# Altium project mcu_board.PrjPCB
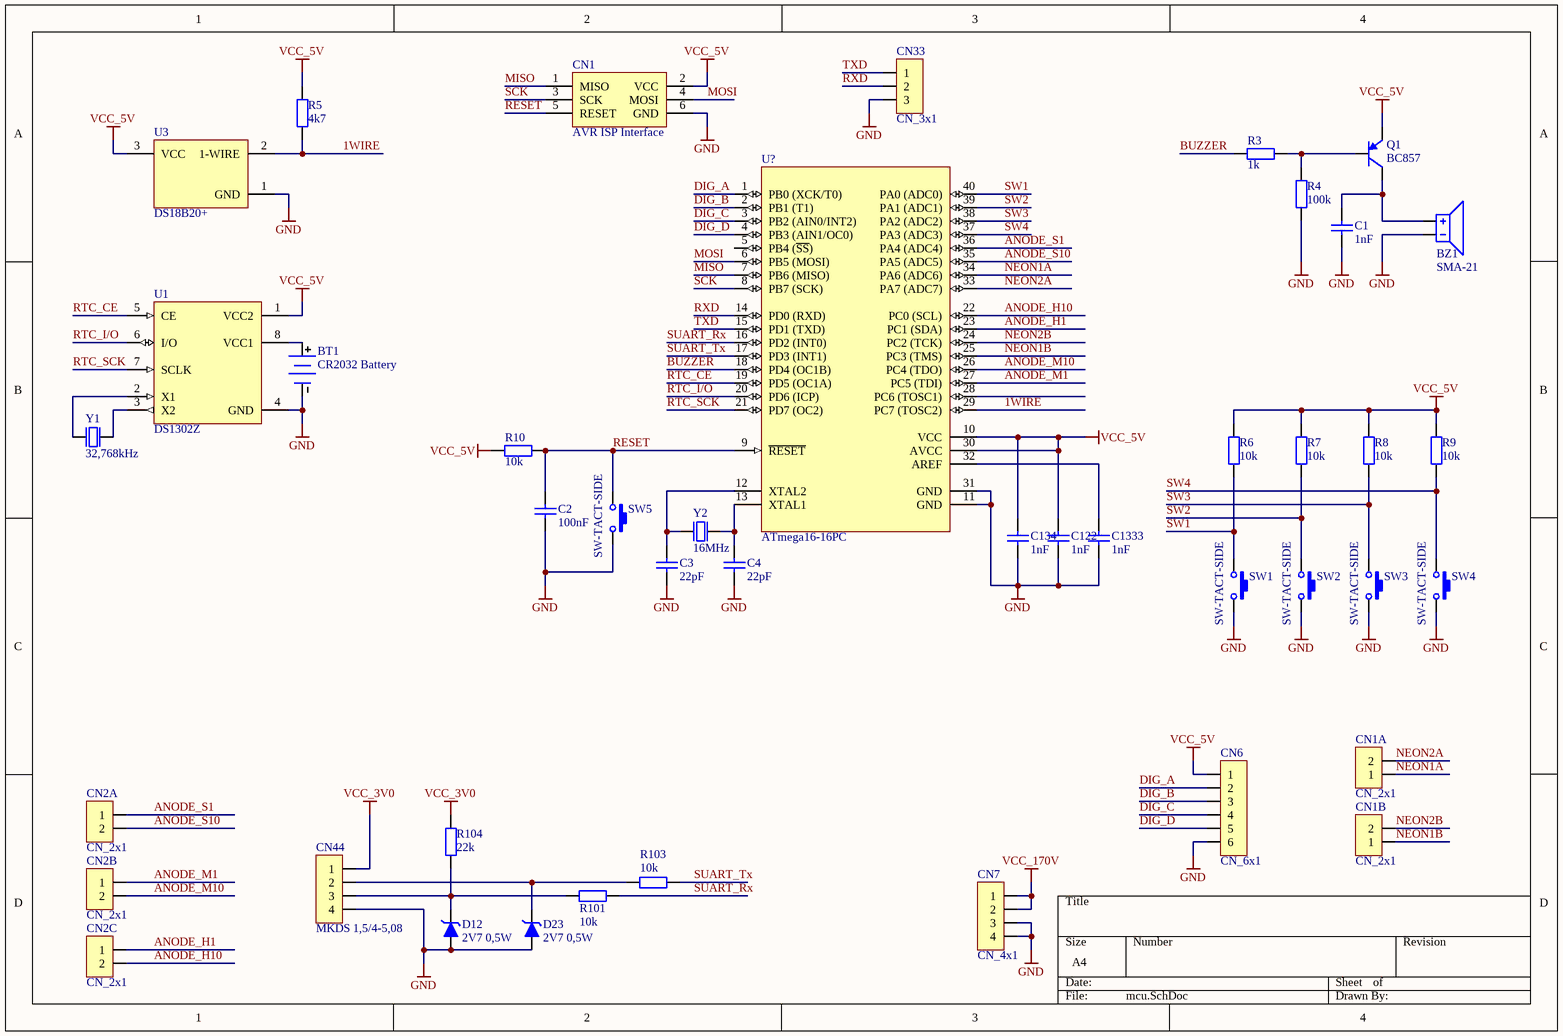
[diagram p0: mcu.SchDoc]
2 sheets, 74 parts. Net scope: global (net labels, ports and power ports of the same name join across sheets).
Board file: mcu_board.PcbDoc
Sheets:
  mcu.SchDoc
  power.SchDoc

## Sheet mcu.SchDoc
size A4

### Parts
BT1  CR2032 Battery  [SN2032]
BZ1  SMA-21  [SMA-21 P10]
C1  1nF  [C0805]
C2  100nF  [C0805]
C3  22pF  [C0805]
C4  22pF  [C0805]
C122  1nF  [C0805]
C134  1nF  [C0805]
C1333  1nF  [C0805]
CN1  AVR ISP Interface  [IDC6_RA]
CN1A  CN_2x1  [GP_2x1]
CN1B  CN_2x1  [GP_2x1]
CN2A  CN_2x1  [GP_2x1]
CN2B  CN_2x1  [GP_2x1]
CN2C  CN_2x1  [GP_2x1]
CN6  CN_6x1  [GP_6x1]
CN7  CN_4x1  [GP_4x1]
CN33  CN_3x1  [GP_3x1H]
CN44  MKDS 1,5/4-5,08  [MKDS 1,5/4-5,08]
D12  2V7 0,5W  [MiniMELF]
D23  2V7 0,5W  [MiniMELF]
Q1  BC857  [SOT-23]
R3  1k  [R0805]
R4  100k  [R0805]
R5  4k7  [R0805]
R6  10k  [R0805]
R7  10k  [R0805]
R8  10k  [R0805]
R9  10k  [R0805]
R10  10k  [R0805]
R101  10k  [R0805]
R103  10k  [R0805]
R104  22k  [R0805]
SW1  SW-TACT-SIDE  [TACT_SO_THT]
SW2  SW-TACT-SIDE  [TACT_SO_THT]
SW3  SW-TACT-SIDE  [TACT_SO_THT]
SW4  SW-TACT-SIDE  [TACT_SO_THT]
SW5  SW-TACT-SIDE  [TACT_SO_THT]
U1  DS1302Z  [SO8]
U3  DS18B20+  [TO-92D]
U?  ATmega16-16PC  [DIP40]
Y1  32,768kHz  [85SMX]
Y2  16MHz  [HC49-S]

### Nets
GND: BT1.2(-) BZ1.2 C1.1 C2.1 C3.1 C4.1 C122.1 C134.1 C1333.1 CN1.6(GND) CN6.6 CN7.3 CN7.4 CN33.3 CN44.4 D12.1(A) D23.1(A) R4.1 SW1.2 SW1.3 SW1.4 SW2.2 SW2.3 SW2.4 SW3.2 SW3.3 SW3.4 SW4.2 SW4.3 SW4.4 SW5.2 SW5.3 SW5.4 U1.4(GND) U3.1(GND) U?.11(GND) U?.31(GND)
VCC_3V0: CN44.1 R104.1
VCC_5V: C122.2 C134.2 CN1.2(VCC) CN6.1 Q1.2(E) R5.2 R6.2 R7.2 R8.2 R9.2 R10.2 U1.1(VCC2) U3.3(VCC) U?.10(VCC) U?.30(AVCC)
VCC_170V: CN7.1 CN7.2
1WIRE: R5.1 U3.2(1-WIRE) U?.29(PC7_(TOSC2))
ANODE_H1: CN2C.1 U?.23(PC1_(SDA))
ANODE_H10: CN2C.2 U?.22(PC0_(SCL))
ANODE_M1: CN2B.1 U?.27(PC5_(TDI))
ANODE_M10: CN2B.2 U?.26(PC4_(TDO))
ANODE_S1: CN2A.1 U?.36(PA4_(ADC4))
ANODE_S10: CN2A.2 U?.35(PA5_(ADC5))
BUZZER: R3.2 U?.18(PD4_(OC1B))
DIG_A: CN6.2 U?.1(PB0_(XCK/T0))
DIG_B: CN6.3 U?.2(PB1_(T1))
DIG_C: CN6.4 U?.3(PB2_(AIN0/INT2))
DIG_D: CN6.5 U?.4(PB3_(AIN1/OC0))
MISO: CN1.1(MISO) U?.7(PB6_(MISO))
MOSI: CN1.4(MOSI) U?.6(PB5_(MOSI))
NEON1A: CN1A.1 U?.34(PA6_(ADC6))
NEON1B: CN1B.1 U?.25(PC3_(TMS))
NEON2A: CN1A.2 U?.33(PA7_(ADC7))
NEON2B: CN1B.2 U?.24(PC2_(TCK))
RESET: C2.2 CN1.5(RESET) R10.1 SW5.1 U?.9(~{RESET})
RTC_CE: U1.5(CE) U?.19(PD5_(OC1A))
RTC_I/O: U1.6(I/O) U?.20(PD6_(ICP))
RTC_SCK: U1.7(SCLK) U?.21(PD7_(OC2))
RXD: CN33.2 U?.14(PD0_(RXD))
SCK: CN1.3(SCK) U?.8(PB7_(SCK))
SUART_Rx: R101.1 U?.16(PD2_(INT0))
SUART_Tx: R103.1 U?.17(PD3_(INT1))
SW1: R6.1 SW1.1 U?.40(PA0_(ADC0))
SW2: R7.1 SW2.1 U?.39(PA1_(ADC1))
SW3: R8.1 SW3.1 U?.38(PA2_(ADC2))
SW4: R9.1 SW4.1 U?.37(PA3_(ADC3))
TXD: CN33.1 U?.15(PD1_(TXD))
NetBT1_1: BT1.1(+) U1.8(VCC1)
NetBZ1_1: BZ1.1 C1.2 Q1.3(C)
NetC3_2: C3.2 U?.12(XTAL2) Y2.1(OSC1)
NetC4_2: C4.2 U?.13(XTAL1) Y2.2(OSC2)
NetC1333_2: C1333.2 U?.32(AREF)
NetCN44_2: CN44.2 D23.2(K) R103.2
NetCN44_3: CN44.3 D12.2(K) R101.2 R104.2
NetQ1_1: Q1.1(B) R3.1 R4.2
NetU1_2: U1.2(X1) Y1.1(OSC1)
NetU1_3: U1.3(X2) Y1.2(OSC2)

Not connected (* = marked no-connect by the designer): U? 5(PB4_(~{SS})) 28(PC6_(TOSC1))

### Library data of the parts
BZ1 = SMA21: Sonitron 21mm Piezo Buzzer
C1-C4 C122 C134 C1333 = Cap: Capacitor; ComponentLink1Description: datasheet; ComponentLink2Description: supplier
  C1 C122 C134 C1333: Value: 1nF
  C2: Value: 100nF
  C3 C4: Value: 22pF
CN1 = AVR ISP Interface: ISP Programming Header for AVR MCU's
D12 D23 = BZV55C2V7: Zener Diode 2V7, 0,5W
Q1 = BC857: PNP General Purpose Transistor (VCE=-45V, IC=-100mA)
R3-R10 R101 R103 R104 = Res: Resistor; Published: 19-Feb-2006; ComponentLink1Description: datasheet; ComponentLink2Description: supplier
  R3: Value: 1k
  R4: Value: 100k
  R5: Value: 4k7
  R6-R10 R101 R103: Value: 10k
  R104: Value: 22k
SW1-SW5 = SW-TACT-SIDE: Side-operated Tactile Switch; Published: 30-Jun-2006
U1 = DS1302Z: Trickle-Charge Timekeeping Chip
U3 = DS18B20+: DS18B20+ (TO92) 1-Wire Digital Thermometer
U? = ATmega16-16PC: 8-Bit AVR Microcontroller with 16K Bytes of In-System Programmable Flash Memory; Package Information: Latest Revision: Dec-1999; Published: 17-Sep-2003; Datasheet: Latest Revision: 2466E-AVR-10/02; Package Reference: 40P6; Publisher: Altium Limited
Y1 = Clock XTAL: Crystal Clock Oscillator; ComponentLink1Description: datasheet; ComponentLink2Description: supplier; Value: 32,768kHz
Y2 = XTAL: Crystal Oscillator; ComponentLink1Description: datasheet; ComponentLink2Description: supplier; Value: 16MHz
BT1 = CR2032 Battery: Published: 24-Mar-1999; Revision: July-2002: Re-released for DXP Platform.; Publisher: Altium Limited

## Sheet power.SchDoc
size A4
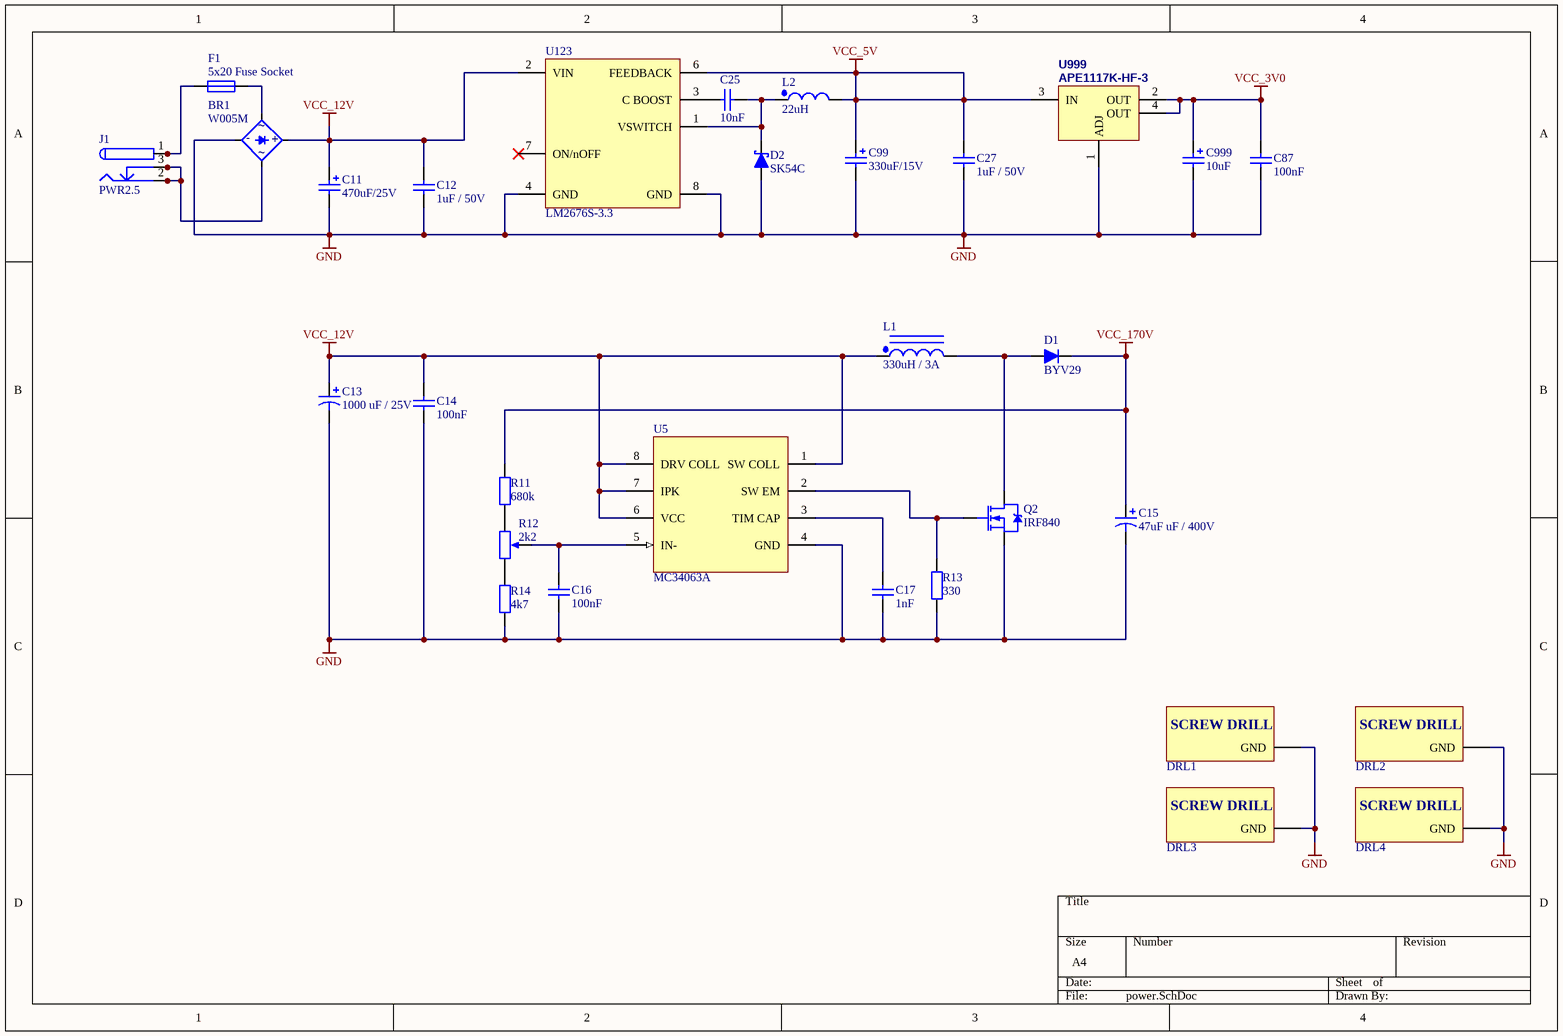
[diagram p1: power.SchDoc]

### Parts
BR1  W005M  [WxxM]
C11  470uF/25V  [SMDC]
C12  1uF / 50V  [C0805]
C13  1000 uF / 25V  [CE10x20-5_RA]
C14  100nF  [C0805]
C15  47uF uF / 400V  [CE10x20-5_RA]
C16  100nF  [C0805]
C17  1nF  [C0805]
C25  10nF  [C0805]
C27  1uF / 50V  [C0805]
C87  100nF  [C0805]
C99  330uF/15V  [SMDC]
C999  10uF  [SMDB]
D1  BYV29  [TO-220-2_RA]
D2  SK54C  [SMC]
DRL1  SCREW DRILL  [3mm screw drill I]  (value not drawn)
DRL2  SCREW DRILL  [3mm screw drill I]  (value not drawn)
DRL3  SCREW DRILL  [3mm screw drill I]  (value not drawn)
DRL4  SCREW DRILL  [3mm screw drill I]  (value not drawn)
F1  5x20 Fuse Socket  [Bezp 5x20 uniw II]
J1  PWR2.5  [KLD-0202]
L1  330uH / 3A  [IND_15_POZIOMO]
L2  22uH  [DE1207]
Q2  IRF840  [TO-220AB_RA_H1]
R11  680k  [R0805]
R12  2k2  [RPot_wieloob_19mm_lezacy]
R13  330  [R0805]
R14  4k7  [R0805]
U5  MC34063A  [SO8]
U123  LM2676S-3.3  [TO-263-7 (D2PAK-7)]
U999  APE1117K-HF-3  [SOT-223]

### Nets
GND: BR1.4(-) C11.2 C12.1 C13.2 C14.1 C15.2 C16.1 C17.1 C27.1 C87.1 C99.2 C999.2 D2.1(A) DRL1.0(GND) DRL2.0(GND) DRL3.0(GND) DRL4.0(GND) Q2.3(S) R13.1 R14.1 U5.4(GND) U123.4(GND) U123.8(GND) U999.1(ADJ)
VCC_3V0: C87.2 C999.1 U999.2(OUT) U999.4(OUT)
VCC_5V: C27.2 C99.1 L2.2 U123.6(FEEDBACK) U999.3(IN)
VCC_12V: BR1.1(+) C11.1 C12.2 C13.1 C14.2 L1.1 U5.1(SW_COLL) U5.6(VCC) U5.7(IPK) U5.8(DRV_COLL) U123.2(VIN)
VCC_170V: C15.1 D1.2(K) R11.2
NetBR1_2: BR1.2(AC) F1.2
NetBR1_3: BR1.3(AC) J1.2 J1.2A J1.2B J1.3 J1.3A J1.3B
NetC16_2: C16.2 R12.3(TAP) U5.5(IN-)
NetC17_2: C17.2 U5.3(TIM_CAP)
NetC25_1: C25.1 D2.2(K) L2.1 U123.1(VSWITCH)
NetC25_2: C25.2 U123.3(C_BOOST)
NetD1_1: D1.1(A) L1.2 Q2.2(D)
NetF1_1: F1.1 J1.1 J1.1A J1.1B
NetQ2_1: Q2.1(G) R13.2 U5.2(SW_EM)
NetR11_1: R11.1 R12.2(BOT)
NetR12_1: R12.1(TOP) R14.2

Not connected (* = marked no-connect by the designer): U123 5(NC) 7(ON/nOFF)*

### Notes on the sheet
- (in symbol W005M) ~

### Library data of the parts
BR1 = W005M: 50V, 1,5A, Single Phase Silicone Bridge Rectifier, DC Components; Published: 8-Jun-2000; LatestRevisionDate: 29-May-2009; LatestRevisionNote: Sch pins A & K swapped.; DatasheetVersion: E2732B; PackageReference: D-38; Publisher: Altium Limited; PackageDescription: Bridge Rectifier; 4 Terminals; Body 9.4 x 9.4 mm (typ); Pitch 5.08 mm
C11 C99 C999 = Cap Pol Tant: Polarized Tantalum Capacitor; ComponentLink1Description: datasheet; ComponentLink2Description: supplier
  C11: Value: 470uF/25V
  C99: Value: 330uF/15V
  C999: Value: 10uF
C12 C14 C16 C17 C25 C27 C87 = Cap: Capacitor; ComponentLink1Description: datasheet; ComponentLink2Description: supplier
  C12 C27: Value: 1uF / 50V
  C14 C16 C87: Value: 100nF
  C17: Value: 1nF
  C25: Value: 10nF
C13 C15 = Cap Pol: Polarized Capacitor; ComponentLink1Description: datasheet; ComponentLink2Description: supplier
  C13: Value: 1000 uF / 25V
  C15: Value: 47uF uF / 400V
D1 = BYV29: Rectifier diodes ultrafast; Published: 07-May-2007
D2 = SK54C: Schottky Diode: 40V, 5A; Published: 08-Mar-2006; PackageReference: SOT-23
F1 = Fuse Socket: Published: 8-Jun-2000; LatestRevisionDate: 17-Jul-2002; LatestRevisionNote: Re-released for DXP Platform.; PackageReference: PIN-W2/E2.8; Publisher: Altium Limited; PackageDescription: Thru-Hole; 2 Leads
J1 = PWR2.5: Low Voltage Power Supply Connector; Published: 17-Dec-2003; DatasheetDocument: 09-May-2002; Publisher: Altium Limited; ComponentLink1Description: Manufacturer Link; ComponentLink1URL: http://domino.kycon.com/internet/Products.html
L1 = InducCore: Magnetic-Core Inductor with Winding Polarity Marking; Published: 08-Mar-2006; Value: 330uH / 3A
L2 = Ind: Inductor; Published: 08-Mar-2006; ComponentLink1Description: datasheet; ComponentLink2Description: supplier; value: 22uH
Q2 = IRF840: N-Channel Power MOSFET; Published: 22-Jan-2007; Package Reference: TO-220
R11 R13 R14 = Res: Resistor; Published: 19-Feb-2006; ComponentLink1Description: datasheet; ComponentLink2Description: supplier
  R11: Value: 680k
  R13: Value: 330
  R14: Value: 4k7
R12 = RPot: Potentiometer; Published: 03-Apr-2006; Value: 2k2
U5 = MC34063A: 1.5 A, Step-Up/Down/Inverting Switching Regulator; Published: 22-Nov-2006; PackageReference: SO8
U123 = LM2676S-3.3: High Efficiency 3A Step-Down Simple Switcher 3.3V Regulator in TO-263 (D2PAK)
U999 = APE1117K-HF-3: 800mA Low-Dropout Adjustable, 1A Linear Regulator, SOT223 Package; Published: 24-Aug-2001; LatestRevisionDate: 06-Jun-2005; LatestRevisionNote: PCB Pin sequence re-ordered.; DatasheetVersion: Feb-2004; PackageVersion: Jul-2004; PackageReference: TO-220A; Publisher: Altium Limited; PackageDescription: TO, Thru-Hole, Vertical, Heatsink Mounted; 3 In-Line Leads; Pitch 2.54 mm; ComponentLink1Description: Manufacturer Link; ComponentLink1URL: http://www.st.com/; ComponentLink2Description: Datasheet; ComponentLink2URL: http://www.st.com/stonline/books/pdf/docs/2574.pdf; Supplier 1: TME; Supplier Part Number 1: APE1117K-HF-3

## Nets that join several sheets
GND: mcu (37 pins), power (24 pins)
VCC_3V0: mcu (CN44.1 R104.1), power (C87.2 C999.1 U999.2 U999.4)
VCC_5V: mcu (15 pins), power (5 pins)
VCC_170V: mcu (CN7.1 CN7.2), power (C15.1 D1.2 R11.2)